# EasyEDA schematic AirMeter.io Sensor Assembly v1.0.json
TITLE: Sheet_1; REV: 1.0; Date: 2022-07-23; Sheet: 1/1; Company: Your Company
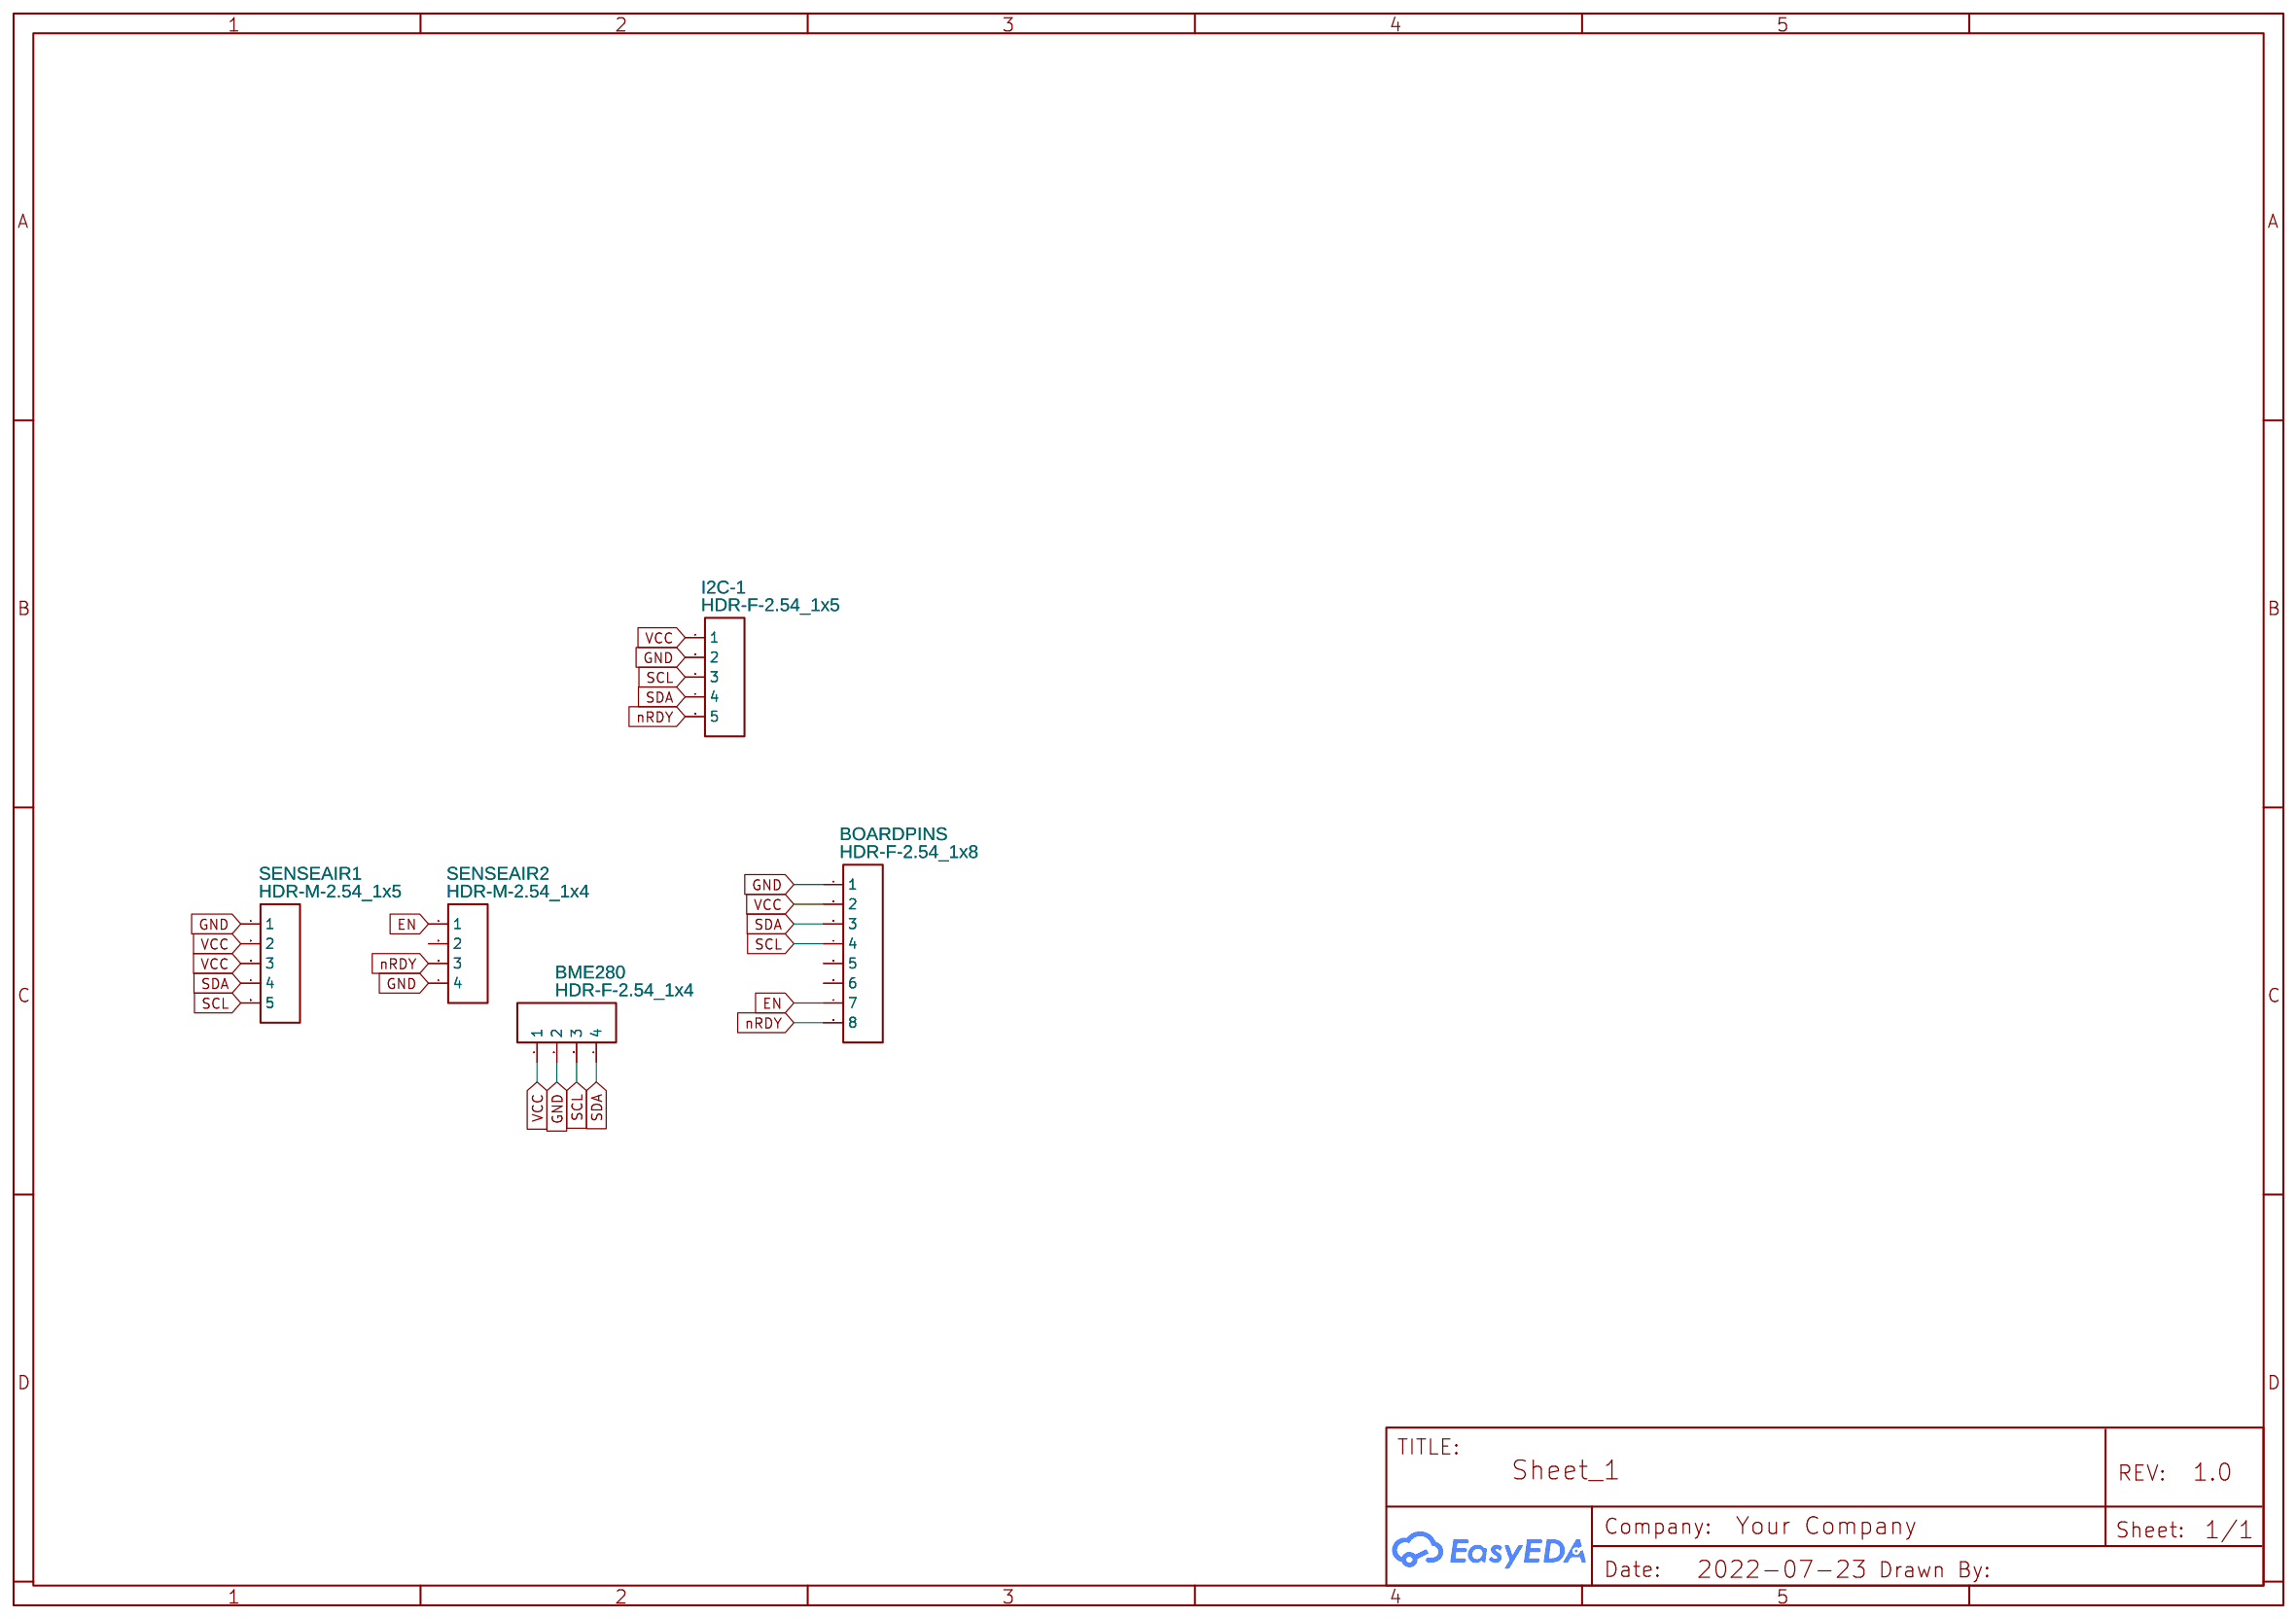
[diagram p0: schematic sheet]

## Parts
BME280  HDR-F-2.54_1x4  [HDR-F-2.54_1X4]
BOARDPINS  HDR-F-2.54_1x8  [HDR-F-2.54_1X8]
I2C-1  HDR-F-2.54_1x5  [HDR-F-2.54_1X5]
SENSEAIR1  HDR-M-2.54_1x5  [HDR-M-2.54_1X5]
SENSEAIR2  HDR-M-2.54_1x4  [HDR-M-2.54_1X4]

## Library data of the parts
BME280 = HDR-F-2.54_1x4: Supplier Part: C225501; Supplier: LCSC; Contributor: LCEDA_Lib
BOARDPINS = HDR-F-2.54_1x8: Supplier Part: C225505; Supplier: LCSC; Contributor: LCEDA_Lib
I2C-1 = HDR-F-2.54_1x5: Supplier Part: C50950; Supplier: LCSC; Contributor: LCEDA_Lib
SENSEAIR1 = HDR-M-2.54_1x5: Supplier Part: C358687; Supplier: LCSC; Contributor: LCEDA_Lib
SENSEAIR2 = HDR-M-2.54_1x4: Supplier Part: C124378; Supplier: LCSC; Contributor: LCEDA_Lib

## Nets
GND: BME280.2 BOARDPINS.1 I2C-1.2 SENSEAIR1.1 SENSEAIR2.4
VCC: BME280.1 BOARDPINS.2 I2C-1.1 SENSEAIR1.2 SENSEAIR1.3
EN: BOARDPINS.7 SENSEAIR2.1
nRDY: BOARDPINS.8 I2C-1.5 SENSEAIR2.3
SCL: BME280.3 BOARDPINS.4 I2C-1.3 SENSEAIR1.5
SDA: BME280.4 BOARDPINS.3 I2C-1.4 SENSEAIR1.4

Not connected (* = marked no-connect by the designer): BOARDPINS 5 6; SENSEAIR2 2
